# Altium schematic sheet REVISION HISTORY.SchDoc
size A3; SheetNumber: 13; SheetTotal: 13
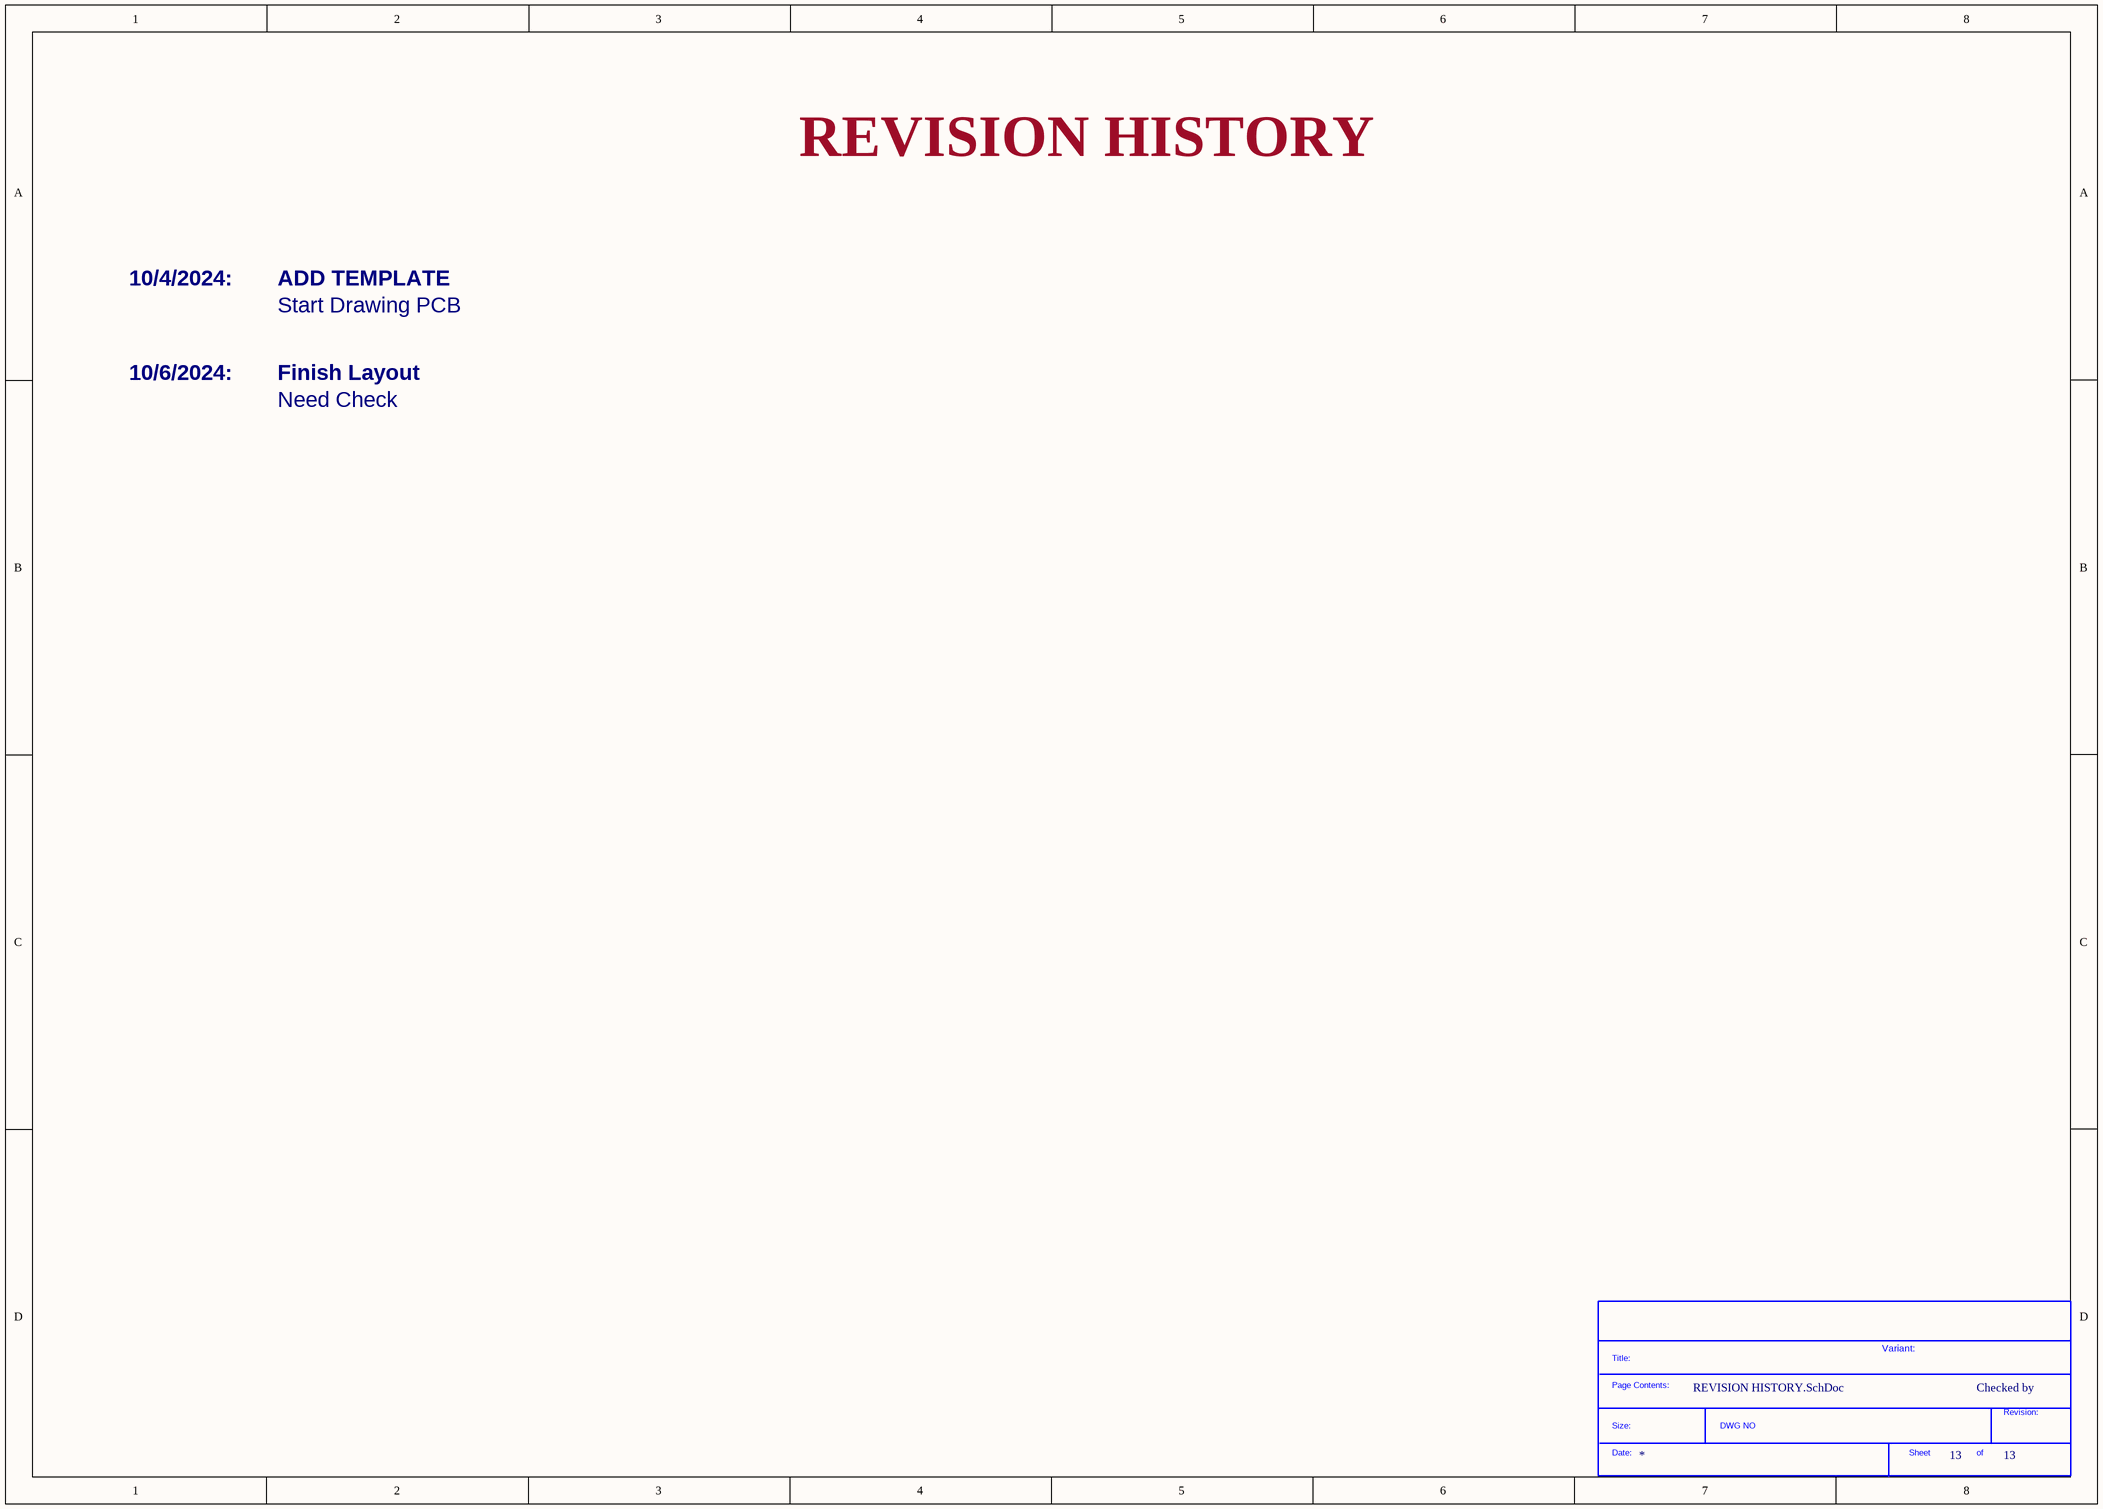
[diagram p0: REVISION HISTORY.SchDoc]

## Parts
*?  SDTitleBlock  (value not drawn)  (graphical)

## Notes on the sheet
- REVISION HISTORY
- 10/4/2024:
- ADD TEMPLATE
- Start Drawing PCB
- 10/6/2024:
- Finish Layout
- Need Check
- Variant:
- Checked by
- (in symbol SDTitleBlock) Title:; Page Contents:; Revision:; Size:; DWG NO; Date:; Sheet; of